# Altium schematic sheet kilif_rev1.SchDoc
size A4
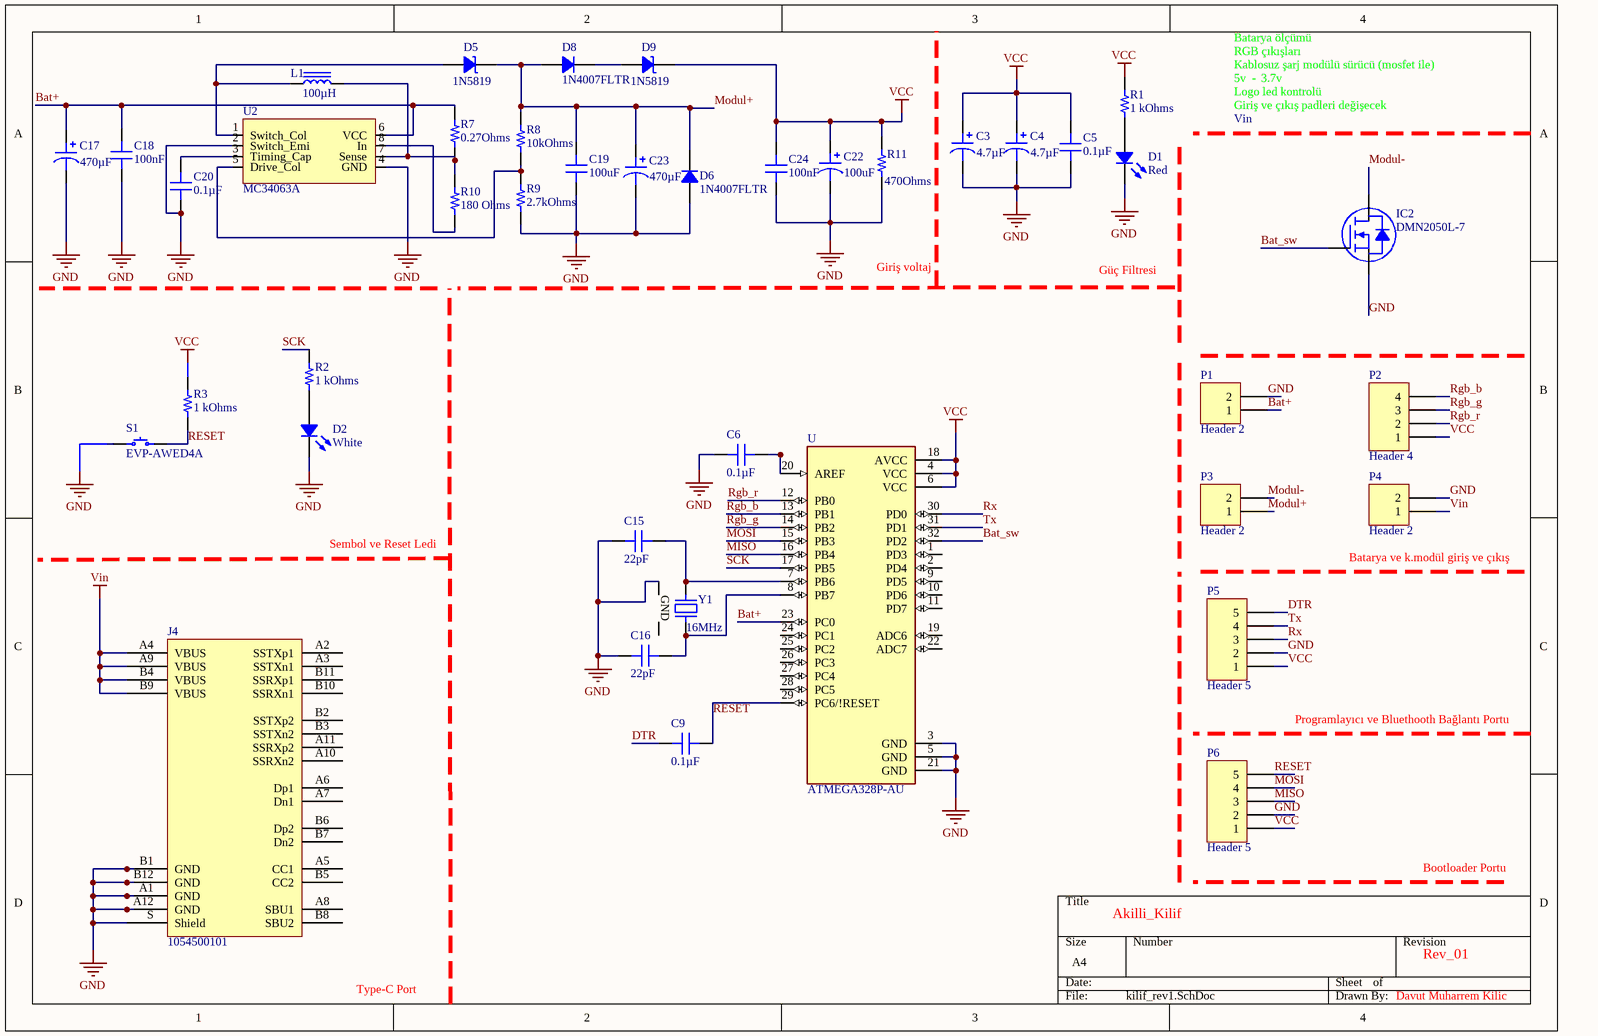
[diagram p0: kilif_rev1.SchDoc]

## Parts
C3  4.7µF  [CAP POL 1206_3216]
C4  4.7µF  [CAP POL 1206_3216]
C5  0.1µF  [CAP 0603_1608]
C6  0.1µF  [CAP 0603_1608]
C9  0.1µF  [CAP 0603_1608]
C15  22pF  [CAP 0603_1608]
C16  22pF  [CAP 0603_1608]
C17  470µF  [CAP POL 1206_3216]
C18  100nF  [CAP 0603_1608]
C19  100uF  [CAP 0603_1608]
C20  0.1µF  [CAP 0603_1608]
C22  100uF  [CAP POL 1206_3216]
C23  470µF  [CAP POL 1206_3216]
C24  100nF  [CAP 0603_1608]
D1  Red  [LED 0805_2012 RED]
D2  White  [LED 1206_3216]
D5  1N5819  [SMF DO-219AB]
D6  1N4007FLTR  [SOD123F]
D8  1N4007FLTR  [SOD123F]
D9  1N5819  [SMF DO-219AB]
IC2  DMN2050L-7  [DIODES SOT-23-3]
J4  1054500101  [Molex 1054500101]
L1  100µH  [TDK VLCF4028-2]
P1  Header 2  [HDR1X2]
P2  Header 4  [HDR1X4]
P3  Header 2  [HDR1X2]
P4  Header 2  [HDR1X2]
P5  Header 5  [HDR1X5]
P6  Header 5  [HDR1X5]
R1  1 kOhms  [RES 0805_2012]
R2  1 kOhms  [RES 0805_2012]
R3  1 kOhms  [RES 0805_2012]
R7  0.27Ohms  [RES 0805_2012]
R8  10kOhms  [RES 0805_2012]
R9  2.7kOhms  [RES 0805_2012]
R10  180 Ohms  [RES 0805_2012]
R11  470Ohms  [RES 0805_2012]
S1  EVP-AWED4A  [PANASONIC EVPAW]
U  ATMEGA328P-AU  [QFP80P900X900X120-32N]
U2  MC34063A  [MC34063A,SOIC127P600X140-8N]
Y1  16MHz  [NDK NX3225SA]

## Nets
GND: C3.2 C4.2 C5.1 C6.1 C15.2 C16.2 C17.2 C18.1 C19.1 C20.1 C22.2 C23.2 C24.1 D1.2 D2.2 D6.1 IC2.2(S) J4.A1(GND) J4.A12(GND) J4.B1(GND) J4.B12(GND) J4.S(Shield) P1.2 P4.2 P5.2 P6.2 R9.1 R11.1 S1.1 U.3(GND) U.5(GND) U.21(GND) U2.2(Switch_Emi) U2.4(GND) Y1.4(GND)
VCC: C3.1 C4.1 C5.2 C22.1 C24.2 D9.2 P2.1 P5.1 P6.1 R1.2 R3.2 R11.2 U.4(VCC) U.6(VCC) U.18(AVCC)
Vin: J4.A4(VBUS) J4.A9(VBUS) J4.B4(VBUS) J4.B9(VBUS) P4.1
Bat+: C17.1 C18.2 P1.1 R7.2 U.23(PC0) U2.6(VCC)
Bat_sw: IC2.1(G) U.32(PD2)
DTR: C9.2 P5.5
MISO: P6.3 U.16(PB4)
Modul+: C19.2 C23.1 D5.2 D6.2 D8.1 P3.1 R8.2
Modul-: IC2.3(D) P3.2
MOSI: P6.4 U.15(PB3)
RESET: C9.1 P6.5 R3.1 S1.2 U.29(PC6/!RESET)
Rgb_b: P2.4 U.13(PB1)
Rgb_g: P2.3 U.14(PB2)
Rgb_r: P2.2 U.12(PB0)
Rx: P5.3 U.30(PD0)
SCK: R2.2 U.17(PB5)
Tx: P5.4 U.31(PD1)
NetC6_2: C6.2 U.20(AREF)
NetC15_1: C15.1 U.7(PB6) Y1.1
NetC16_1: C16.1 U.8(PB7) Y1.3
NetC20_2: C20.2 U2.3(Timing_Cap)
NetD1_1: D1.1 R1.1
NetD2_1: D2.1 R2.1
NetD5_1: D5.1 L1.1 U2.1(Switch_Col)
NetD8_2: D8.2 D9.1
NetL1_2: L1.2 R7.1 R10.2 U2.7(Sense)
NetR8_1: R8.1 R9.2 U2.5(Drive_Col)
NetR10_1: R10.1 U2.8(In)

Not connected (* = marked no-connect by the designer): J4 A2(SSTXp1) A3(SSTXn1) A5(CC1) A6(Dp1) A7(Dn1) A8(SBU1) A10(SSRXn2) A11(SSRXp2) B2(SSTXp2) B3(SSTXn2) B5(CC2) B6(Dp2) B7(Dn2) B8(SBU2) B10(SSRXn1) B11(SSRXp1); U 1(PD3) 2(PD4) 9(PD5) 10(PD6) 11(PD7) 19(ADC6) 22(ADC7) 24(PC1) 25(PC2) 26(PC3) 27(PC4) 28(PC5); Y1 2(GND)

## Notes on the sheet
- Batarya ölçümü
- 5v  -
- Kablosuz şarj modülü sürücü (mosfet ile)
- RGB çıkışları
- Logo led kontrolü
- Giriş ve çıkış padleri değişecek
- 3.7v
- Vin
- Giriş voltaj
- Güç Filtresi
- Sembol ve Reset Ledi
- (near P4) Batarya ve k.modül giriş ve çıkış
- Programlayıcı ve Bluethooth Bağlantı Portu
- Akilli_Kilif
- Bootloader Portu
- Rev_01
- Type-C Port
- Davut Muharrem Kilic

## Library data of the parts
C3 C4 = T55A475M010C0500: CAP TANT POLY 4.7UF 10V 1206; Manufacturer: Vishay Sprague; Manufacturer Size Code: A; ESR (Equivalent Series Resistance): 500mOhm @ 100kHz; Tolerance: ±20%; Type: Molded; Part Number: T55A475M010C0500; Value: 4.7µF; Capacitance: 4.7µF; ComponentLink1Description: Datasheet; ComponentLink1URL: http://www.vishay.com/docs/40174/t55.pdf; ComponentLink2Description: DigiKey Link; ComponentLink2URL: http://digikey.com/product-detail/en/vishay-sprague/T55A475M010C0500/718-2008-1-ND/4989604; Device Package: 1206 (3216 Metric); Features: General Purpose; Height - Seated (Max): 0.071" (1.80mm); LastUpdated: 2.09.2020 01:16:25; Lifecycle Status: Active; Minimum Order: 1; Mounting Type: Surface Mount; Operating Temperature: -55°C ~ 105°C; Package / Case: 1206 (3216 Metric); Packaging: TapeAndReel; PartId: 67; Part Status: Active; Price: 0.32; Series: vPolyTan™ T55; Size / Dimension: 0.126" L x 0.063" W (3.20mm x 1.60mm); Supplier 1: DigiKey; Supplier Part Number 1: 718-2008-1-ND; Voltage - Rated: 10V
C5 C9 C20 = C0603C104K5RAC7411: CAP CER 0.1UF 50V X7R 0603; Manufacturer: KEMET; Tolerance: ±10%; Part Number: C0603C104K5RAC7411; Value: 0.1µF; Applications: Bypass, Decoupling; Capacitance: 0.1µF; ComponentLink1Description: Datasheet; ComponentLink1URL: https://api.kemet.com/component-edge/download/datasheet/C0603C104K5RAC7411.pdf; ComponentLink2Description: DigiKey Link; ComponentLink2URL: http://digikey.com/product-detail/en/kemet/C0603C104K5RAC7411/399-7374-2-ND/3317013; Device Package: 0603 (1608 Metric); LastUpdated: 2.09.2020 01:03:36; Lifecycle Status: Active; Minimum Order: 15000; Mounting Type: Surface Mount, MLCC; Operating Temperature: -55°C ~ 125°C; Package / Case: 0603 (1608 Metric); Packaging: TapeAndReel; PartId: 2233; Part Status: Active; Price: 0.02; Series: SMD Comm X7R; Size / Dimension: 0.063" L x 0.031" W (1.60mm x 0.80mm); Supplier 1: DigiKey; Supplier Part Number 1: 399-7374-2-ND; Temperature Coefficient: X7R; Thickness (Max): 0.035" (0.90mm); Voltage - Rated: 50V
C6 = CS0603KRX7R7BB104: CAP CER 0.1UF 16V X7R 0603; Manufacturer: Yageo; Tolerance: ±10%; Part Number: CS0603KRX7R7BB104; Value: 0.1µF; Applications: Boardflex Sensitive; Capacitance: 0.1µF; ComponentLink1Description: Datasheet; ComponentLink1URL: http://www.yageo.com/NewPortal/yageodocoutput?fileName=/pdf/MLCC/UPY-ST_NPOX7R_16V-to-3KV_5.pdf; ComponentLink2Description: DigiKey Link; ComponentLink2URL: http://digikey.com/product-detail/en/yageo/CS0603KRX7R7BB104/311-3560-1-ND/7648487; Device Package: 0603 (1608 Metric); Features: Soft Termination; LastUpdated: 2.09.2020 01:03:36; Lifecycle Status: Active; Minimum Order: 1; Mounting Type: Surface Mount, MLCC; Operating Temperature: -55°C ~ 125°C; Package / Case: 0603 (1608 Metric); Packaging: TapeAndReel; PartId: 2286; Part Status: Active; Price: 0.02; Series: CS; Size / Dimension: 0.063" L x 0.031" W (1.60mm x 0.80mm); Supplier 1: DigiKey; Supplier Part Number 1: 311-3560-1-ND; Temperature Coefficient: X7R; Thickness (Max): 0.037" (0.95mm); Voltage - Rated: 16V
C15 = C0603C104K5RAC7411: CAP CER 22PfF 50V X7R 0603; Manufacturer: KEMET; Capacitance: 0.1µF; Tolerance: ±10%; Part Number: C0603C104K5RAC7411; Value: 22pF; Applications: Bypass, Decoupling; ComponentLink1Description: Datasheet; ComponentLink1URL: https://api.kemet.com/component-edge/download/datasheet/C0603C104K5RAC7411.pdf; ComponentLink2Description: DigiKey Link; ComponentLink2URL: http://digikey.com/product-detail/en/kemet/C0603C104K5RAC7411/399-7374-2-ND/3317013; Device Package: 0603 (1608 Metric); LastUpdated: 2.09.2020 01:03:36; Lifecycle Status: Active; Minimum Order: 15000; Mounting Type: Surface Mount, MLCC; Operating Temperature: -55°C ~ 125°C; Package / Case: 0603 (1608 Metric); Packaging: TapeAndReel; PartId: 2233; Part Status: Active; Price: 0.02; Series: SMD Comm X7R; Size / Dimension: 0.063" L x 0.031" W (1.60mm x 0.80mm); Supplier 1: DigiKey; Supplier Part Number 1: 399-7374-2-ND; Temperature Coefficient: X7R; Thickness (Max): 0.035" (0.90mm); Voltage - Rated: 50V
C16 = C0603C104K5RAC7411: CAP CER 22PF 50V X7R 0603; Manufacturer: KEMET; Capacitance: 0.1µF; Tolerance: ±10%; Part Number: C0603C104K5RAC7411; Value: 22pF; Applications: Bypass, Decoupling; ComponentLink1Description: Datasheet; ComponentLink1URL: https://api.kemet.com/component-edge/download/datasheet/C0603C104K5RAC7411.pdf; ComponentLink2Description: DigiKey Link; ComponentLink2URL: http://digikey.com/product-detail/en/kemet/C0603C104K5RAC7411/399-7374-2-ND/3317013; Device Package: 0603 (1608 Metric); LastUpdated: 2.09.2020 01:03:36; Lifecycle Status: Active; Minimum Order: 15000; Mounting Type: Surface Mount, MLCC; Operating Temperature: -55°C ~ 125°C; Package / Case: 0603 (1608 Metric); Packaging: TapeAndReel; PartId: 2233; Part Status: Active; Price: 0.02; Series: SMD Comm X7R; Size / Dimension: 0.063" L x 0.031" W (1.60mm x 0.80mm); Supplier 1: DigiKey; Supplier Part Number 1: 399-7374-2-ND; Temperature Coefficient: X7R; Thickness (Max): 0.035" (0.90mm); Voltage - Rated: 50V
C17 C22 C23 = T55A475M010C0500: CAP TANT POLY 4.7UF 10V 1206; Manufacturer: Vishay Sprague; Manufacturer Size Code: A; Capacitance: 4.7µF; ESR (Equivalent Series Resistance): 500mOhm @ 100kHz; Tolerance: ±20%; Type: Molded; Part Number: T55A475M010C0500; ComponentLink1Description: Datasheet; ComponentLink1URL: http://www.vishay.com/docs/40174/t55.pdf; ComponentLink2Description: DigiKey Link; ComponentLink2URL: http://digikey.com/product-detail/en/vishay-sprague/T55A475M010C0500/718-2008-1-ND/4989604; Device Package: 1206 (3216 Metric); Features: General Purpose; Height - Seated (Max): 0.071" (1.80mm); LastUpdated: 2.09.2020 01:16:25; Lifecycle Status: Active; Minimum Order: 1; Mounting Type: Surface Mount; Operating Temperature: -55°C ~ 105°C; Package / Case: 1206 (3216 Metric); Packaging: TapeAndReel; PartId: 67; Part Status: Active; Price: 0.32; Series: vPolyTan™ T55; Size / Dimension: 0.126" L x 0.063" W (3.20mm x 1.60mm); Supplier 1: DigiKey; Supplier Part Number 1: 718-2008-1-ND; Voltage - Rated: 10V
  C17 C23: Value: 470µF
  C22: Value: 100uF
C18 C19 C24 = C0603C104K5RAC7411: CAP CER 0.1UF 50V X7R 0603; Manufacturer: KEMET; Capacitance: 0.1µF; Tolerance: ±10%; Part Number: C0603C104K5RAC7411; Applications: Bypass, Decoupling; ComponentLink1Description: Datasheet; ComponentLink1URL: https://api.kemet.com/component-edge/download/datasheet/C0603C104K5RAC7411.pdf; ComponentLink2Description: DigiKey Link; ComponentLink2URL: http://digikey.com/product-detail/en/kemet/C0603C104K5RAC7411/399-7374-2-ND/3317013; Device Package: 0603 (1608 Metric); LastUpdated: 2.09.2020 01:03:36; Lifecycle Status: Active; Minimum Order: 15000; Mounting Type: Surface Mount, MLCC; Operating Temperature: -55°C ~ 125°C; Package / Case: 0603 (1608 Metric); Packaging: TapeAndReel; PartId: 2233; Part Status: Active; Price: 0.02; Series: SMD Comm X7R; Size / Dimension: 0.063" L x 0.031" W (1.60mm x 0.80mm); Supplier 1: DigiKey; Supplier Part Number 1: 399-7374-2-ND; Temperature Coefficient: X7R; Thickness (Max): 0.035" (0.90mm); Voltage - Rated: 50V
  C18 C24: Value: 100nF
  C19: Value: 100uF
D1 = EAST2012RA1: LED RED CLEAR 2SMD; Manufacturer: Everlight Electronics Co Ltd; Configuration: Standard; Current - Test: 20mA; Lens Color: Colorless; Lens Size: 1.40mm x 1.25mm; Lens Style: Rectangle with Flat Top; Millicandela Rating: 79mcd; Viewing Angle: 120°; Voltage - Forward (Vf) (Typ): 2V; Wavelength - Dominant: 626nm; Wavelength - Peak: 632nm; Part Number: EAST2012RA1; Color: Red; ComponentLink1Description: Datasheet; ComponentLink1URL: https://everlightamericas.com/index.php?controller=attachment&id_attachment=2888; ComponentLink2Description: DigiKey Link; ComponentLink2URL: http://digikey.com/product-detail/en/everlight-electronics-co-ltd/EAST2012RA1/1080-EAST2012RA1CT-ND/11201058; Device Package: 0805 (2012 Metric); Height (Max): 1.00mm; LastUpdated: 2.09.2020 01:21:00; Lens Transparency: Clear; Lifecycle Status: Active; Minimum Order: 1; Mounting Type: Surface Mount; Package / Case: 0805 (2012 Metric); Packaging: TapeAndReel; PartId: 943; Part Status: Active; Price: 0.03; Series: -; Size / Dimension: 2.00mm L x 1.25mm W; Supplier 1: DigiKey; Supplier Part Number 1: 1080-EAST2012RA1CT-ND; Supplier Device Package: 2-SMD; Value: Red
D2 = LTW-C230DS: LED WHITE 1206 SMD; Manufacturer: Lite-On Inc.; Configuration: Independent; Current - Test: 20mA; Lens Color: Yellow; Lens Size: 1.50mm x 1.60mm; Lens Style: Rectangle with Flat Top; Millicandela Rating: 315mcd; Viewing Angle: 130°; Voltage - Forward (Vf) (Typ): 3.2V; Part Number: LTW-C230DS; Color: White; ComponentLink1Description: Datasheet; ComponentLink1URL: http://optoelectronics.liteon.com/upload/download/DS22-2007-0232/LTW-C230DS.pdf; ComponentLink2Description: DigiKey Link; ComponentLink2URL: http://digikey.com/product-detail/en/lite-on-inc/LTW-C230DS/160-2221-1-ND/7597462; Device Package: 1206 (3216 Metric); Height (Max): 1.10mm; LastUpdated: 2.09.2020 01:22:59; Lifecycle Status: Active; Minimum Order: 1; Mounting Type: Surface Mount; Package / Case: 1206 (3216 Metric); Packaging: TapeAndReel; PartId: 933; Part Status: Active; Price: 0.13; Series: -; Size / Dimension: 3.20mm L x 1.60mm W; Supplier 1: DigiKey; Supplier Part Number 1: 160-2221-1-ND; Supplier Device Package: 1206; Value: White
D5 D9 = SMF45A-E3-08: TVS DIODE 45V 72.7V DO219AB; Manufacturer: Vishay Semiconductor Diodes Division; Capacitance @ Frequency: 162pF @ 1MHz; Current - Peak Pulse (10/1000µs): 2.8A; Power Line Protection: No; Power - Peak Pulse: 200W; Type: Zener; Unidirectional Channels: 1; Voltage - Breakdown (Min): 50V; Part Number: SMF45A-E3-08; Applications: General Purpose; ComponentLink1Description: Datasheet; ComponentLink1URL: http://www.vishay.com/docs/85881/smf5v0atosmf58a.pdf; ComponentLink2Description: DigiKey Link; ComponentLink2URL: http://digikey.com/product-detail/en/vishay-semiconductor-diodes-division/SMF45A-E3-08/SMF45A-E3-08GICT-ND/5639183; LastUpdated: 2.09.2020 01:27:45; Lifecycle Status: Active; Minimum Order: 1; Mounting Type: Surface Mount; Operating Temperature: -65°C ~ 175°C (TJ); Package / Case: DO-219AB; Packaging: TapeAndReel; PartId: 5508; Part Status: Active; Price: 0.10; Series: -; Supplier 1: DigiKey; Supplier Part Number 1: SMF45A-E3-08GICT-ND; Supplier Device Package: SMF; Voltage - Clamping (Max) @ Ipp: 72.7V; Voltage - Reverse Standoff (Typ): 45V
D6 D8 = 1N4007FLTR: STANDARD RECTIFIER 1000V SOD-123; Manufacturer: SMC Diode Solutions; Capacitance @ Vr, F: 15pF @ 4V, 1MHz; Current - Average Rectified (Io): 1A; Current - Reverse Leakage @ Vr: 5µA @ 1000V; Speed: Standard Recovery >500ns, > 200mA (Io); Voltage - Forward (Vf) (Max) @ If: 1.1V @ 1A; Part Number: 1N4007FLTR; ComponentLink1Description: Datasheet; ComponentLink1URL: http://www.smc-diodes.com/propdf/1N4001FL-1N4007FL%20N1646%20REV.A.pdf; ComponentLink2Description: DigiKey Link; ComponentLink2URL: http://digikey.com/product-detail/en/smc-diode-solutions/1N4007FLTR/1655-1N4007FLCT-ND/11657827; Diode Type: Standard; LastUpdated: 30.08.2020 20:59:55; Lifecycle Status: Active; Minimum Order: 1; Mounting Type: Surface Mount; Package / Case: SOD-123F; Packaging: TapeAndReel; PartId: 3314; Price: 0.01; Supplier 1: DigiKey; Supplier Part Number 1: 1655-1N4007FLCT-ND; Supplier Device Package: SOD-123FL; Voltage - DC Reverse (Vr) (Max): 1000V
IC2 = DMN2050L-7: MOSFET N-CH 20V 5.9A SOT23-3; Manufacturer: Diodes Incorporated; Current - Continuous Drain (Id) @ 25°C: 5.9A (Ta); Drive Voltage (Max Rds On,  Min Rds On): 2V, 4.5V; FET Type: N-Channel; Gate Charge (Qg) (Max) @ Vgs: 6.7nC @ 4.5V; Input Capacitance (Ciss) (Max) @ Vds: 532pF @ 10V; Power Dissipation (Max): 1.4W (Ta); Rds On (Max) @ Id, Vgs: 29mOhm @ 5A, 4.5V; Vgs (Max): ±12V; Vgs(th) (Max) @ Id: 1.4V @ 250µA; Part Number: DMN2050L-7; ComponentLink1Description: Datasheet; ComponentLink1URL: https://www.diodes.com/assets/Datasheets/ds31502.pdf; ComponentLink2Description: DigiKey Link; ComponentLink2URL: http://digikey.com/product-detail/en/diodes-incorporated/DMN2050L-7/DMN2050LDICT-ND/1964751; Drain to Source Voltage (Vdss): 20V; LastUpdated: 2.09.2020 01:25:02; Lifecycle Status: Active; Minimum Order: 1; Mounting Type: Surface Mount; Operating Temperature: -55°C ~ 150°C (TJ); Package / Case: TO-236-3, SC-59, SOT-23-3; Packaging: TapeAndReel; Part Status: Active; Price: 0.12; Series: -; Supplier 1: DigiKey; Supplier Part Number 1: DMN2050LDICT-ND; Supplier Device Package: SOT-23-3; Technology: MOSFET (Metal Oxide)
J4 = 1054500101: CONN RCP USB3.1 TYPEC 24P SMD RA; Manufacturer: Molex; Connector Type: USB - C (Type - C); Current Rating (Amps): 0.25A, 1A, 5A; Gender: Receptacle; Mating Cycles: 10000; Number of Contacts: 24; Number of Ports: 1; Shielding: Shielded; Specifications: USB 3.1 (USB 3.1 Gen 2, Superspeed+); Voltage - Rated: 30VAC/DC; Part Number: 1054500101; ComponentLink1Description: Datasheet; ComponentLink1URL: https://www.molex.com/pdm_docs/ps/PS-105448-001.pdf; ComponentLink2Description: DigiKey Link; ComponentLink2URL: http://digikey.com/product-detail/en/molex/1054500101/WM12856CT-ND/5843891; LastUpdated: 6.06.2020 02:14:04; Lifecycle Status: Active; Minimum Order: 1; Mounting Feature: Horizontal; Mounting Type: Surface Mount, Right Angle; Through Hole; Operating Temperature: -30°C ~ 85°C; Packaging: TapeAndReel; Part Status: Active; Price: 1.22; Series: 105445; Supplier 1: DigiKey; Supplier Part Number 1: WM12856CT-ND; Termination: Solder
L1 = VLCF5028T-101MR33-2: FIXED IND 100UH 330MA 670 MOHM; Manufacturer: TDK Corporation; DC Resistance (DCR): 670mOhm Max; Inductance Frequency - Test: 100kHz; Material - Core: Ferrite; Shielding: Shielded; Tolerance: ±20%; Type: Wirewound; Part Number: VLCF5028T-101MR33-2; ComponentLink1Description: Datasheet; ComponentLink1URL: https://product.tdk.com/info/en/catalog/datasheets/inductor_commercial_power_vlcf5028-2_en.pdf?ref_disty=digikey; ComponentLink2Description: DigiKey Link; ComponentLink2URL: http://digikey.com/product-detail/en/tdk-corporation/VLCF5028T-101MR33-2/445-6555-1-ND/2465861; Current Rating (Amps): 330mA; Current - Saturation: 330mA; Device Package: Nonstandard; Height - Seated (Max): 0.110" (2.80mm); Inductance: 100µH; LastUpdated: 2.09.2020 01:22:16; Lifecycle Status: Active; Minimum Order: 1; Mounting Type: Surface Mount; Operating Temperature: -40°C ~ 105°C; Package / Case: Nonstandard; Packaging: TapeAndReel; PartId: 186; Part Status: Active; Price: 0.63; Series: VLCF; Size / Dimension: 0.197" L x 0.197" W (5.00mm x 5.00mm); Supplier 1: DigiKey; Supplier Part Number 1: 445-6555-1-ND; Value: 100µH
P1 P3 P4 = Header 2: Header, 2-Pin; LatestRevisionDate: 17-Jul-2002; LatestRevisionNote: Re-released for DXP Platform.; Publisher: Altium Limited
P2 = Header 4: Header, 4-Pin; LatestRevisionDate: 17-Jul-2002; LatestRevisionNote: Re-released for DXP Platform.; Publisher: Altium Limited
P5 P6 = Header 5: Header, 5-Pin; LatestRevisionDate: 17-Jul-2002; LatestRevisionNote: Re-released for DXP Platform.; Publisher: Altium Limited
R1-R3 = RNCP0805FTD1K00: RES 1K OHM 1% 1/4W 0805; Manufacturer: Stackpole Electronics Inc; Power (Watts): 0.25W, 1/4W; Temperature Coefficient: ±100ppm/°C; Part Number: RNCP0805FTD1K00; Value: 1 kOhms; ComponentLink1Description: Datasheet; ComponentLink1URL: https://www.seielect.com/catalog/sei-rncp.pdf; ComponentLink2Description: DigiKey Link; ComponentLink2URL: http://digikey.com/product-detail/en/stackpole-electronics-inc/RNCP0805FTD1K00/RNCP0805FTD1K00CT-ND/2240568; Composition: Thin Film; Device Package: 0805 (2012 Metric); Features: Anti-Sulfur, Moisture Resistant; Height - Seated (Max): 0.024" (0.60mm); LastUpdated: 2.09.2020 01:15:23; Lifecycle Status: Active; Minimum Order: 1; Number of Terminations: 2; Operating Temperature: -55°C ~ 155°C; Package / Case: 0805 (2012 Metric); Packaging: TapeAndReel; PartId: 28023; Part Status: Active; Price: 0.01; Resistance: 1 kOhms; Series: RNCP; Size / Dimension: 0.079" L x 0.049" W (2.00mm x 1.25mm); Supplier 1: DigiKey; Supplier Part Number 1: RNCP0805FTD1K00CT-ND; Supplier Device Package: 0805; Tolerance: ±1%
R7-R11 = RNCP0805FTD1K00: RES 1K OHM 1% 1/4W 0805; Manufacturer: Stackpole Electronics Inc; Power (Watts): 0.25W, 1/4W; Resistance: 1 kOhms; Temperature Coefficient: ±100ppm/°C; Part Number: RNCP0805FTD1K00; ComponentLink1Description: Datasheet; ComponentLink1URL: https://www.seielect.com/catalog/sei-rncp.pdf; ComponentLink2Description: DigiKey Link; ComponentLink2URL: http://digikey.com/product-detail/en/stackpole-electronics-inc/RNCP0805FTD1K00/RNCP0805FTD1K00CT-ND/2240568; Composition: Thin Film; Device Package: 0805 (2012 Metric); Features: Anti-Sulfur, Moisture Resistant; Height - Seated (Max): 0.024" (0.60mm); LastUpdated: 2.09.2020 01:15:23; Lifecycle Status: Active; Minimum Order: 1; Number of Terminations: 2; Operating Temperature: -55°C ~ 155°C; Package / Case: 0805 (2012 Metric); Packaging: TapeAndReel; PartId: 28023; Part Status: Active; Price: 0.01; Series: RNCP; Size / Dimension: 0.079" L x 0.049" W (2.00mm x 1.25mm); Supplier 1: DigiKey; Supplier Part Number 1: RNCP0805FTD1K00CT-ND; Supplier Device Package: 0805; Tolerance: ±1%
  R7: Value: 0.27Ohms
  R8: Value: 10kOhms
  R9: Value: 2.7kOhms
  R10: Value: 180 Ohms
  R11: Value: 470Ohms
S1 = EVP-AWED4A: 3.0MM X 2.0MM / 3.3N / 0.15MM ST; Manufacturer: Panasonic Electronic Components; Actuator Height off PCB, Vertical: 0.60mm; Actuator Orientation: Top Actuated; Actuator Type: Standard; Circuit: SPST-NO; Contact Rating @ Voltage: 0.02A @ 15VDC; Illumination: Non-Illuminated; Ingress Protection: IP67 - Dust Tight, Waterproof; Operating Force: 330gf; Outline: 3.00mm x 2.00mm; Switch Function: Off-Mom; Part Number: EVP-AWED4A; ComponentLink1Description: Datasheet; ComponentLink1URL: https://industrial.panasonic.com/ac/cdn/e/control/switch/light-touch/catalog/sw_lt_eng_3020s.pdf; ComponentLink2Description: DigiKey Link; ComponentLink2URL: http://digikey.com/product-detail/en/panasonic-electronic-components/EVP-AWED4A/P123440CT-ND/8568287; LastUpdated: 2.09.2020 01:27:07; Lifecycle Status: Active; Minimum Order: 1; Mounting Type: Surface Mount; Operating Temperature: -40°C ~ 85°C; Packaging: TapeAndReel; Part Status: Active; Price: 0.14; Series: EVPAW; Supplier 1: DigiKey; Supplier Part Number 1: P123440CT-ND; Termination Style: SMD (SMT) Tab
U = ATMEGA328P-AU: AVR AVRÂ® ATmega Microcontroller IC 8-Bit 20MHz 32KB _16K x 16_ FLASH 32-TQFP _7x7_; MF: Microchip; Value: *; SnapEDA_Link: https://www.snapeda.com/parts/ATMEGA328P-AU/Microchip/view-part/44280/?ref=snap; MP: ATMEGA328P-AU; Availability: Unavailable; Price: None; Package: TQFP-32 Microchip
U2 = MC34063A: 1.5 A, Step-Up/Down/ / Inverting Switching / Regulators
Y1 = NX3225SA-16.000M-STD-CRS-2: CRYSTAL 16.0000MHZ 8PF SMD; Manufacturer: NDK America, Inc.; ESR (Equivalent Series Resistance): 120 Ohms; Frequency Stability: ±50ppm; Frequency Tolerance: ±15ppm; Operating Mode: Fundamental; Part Number: NX3225SA-16.000M-STD-CRS-2; ComponentLink1Description: Datasheet; ComponentLink1URL: http://www.ndk.com/images/products/catalog/c_NX3225SA-STD-CRS-2_e.pdf; ComponentLink2Description: DigiKey Link; ComponentLink2URL: http://digikey.com/product-detail/en/ndk-america-inc/NX3225SA-16.000M-STD-CRS-2/644-1129-1-ND/1788484; Frequency: 16MHz; Height - Seated (Max): 0.024" (0.60mm); LastUpdated: 2.09.2020 01:21:59; Lifecycle Status: Active; Load Capacitance: 8pF; Minimum Order: 1; Mounting Type: Surface Mount; Operating Temperature: -40°C ~ 125°C; Package / Case: 4-SMD, No Lead; Packaging: TapeAndReel; PartId: 598; Part Status: Active; Price: 0.54; Ratings: AEC-Q200; Series: NX3225SA; Size / Dimension: 0.126" L x 0.098" W (3.20mm x 2.50mm); Supplier 1: DigiKey; Supplier Part Number 1: 644-1129-1-ND; Type: MHz Crystal; Value: 16MHz